# EAGLE schematic box (EAGLE 6.1)
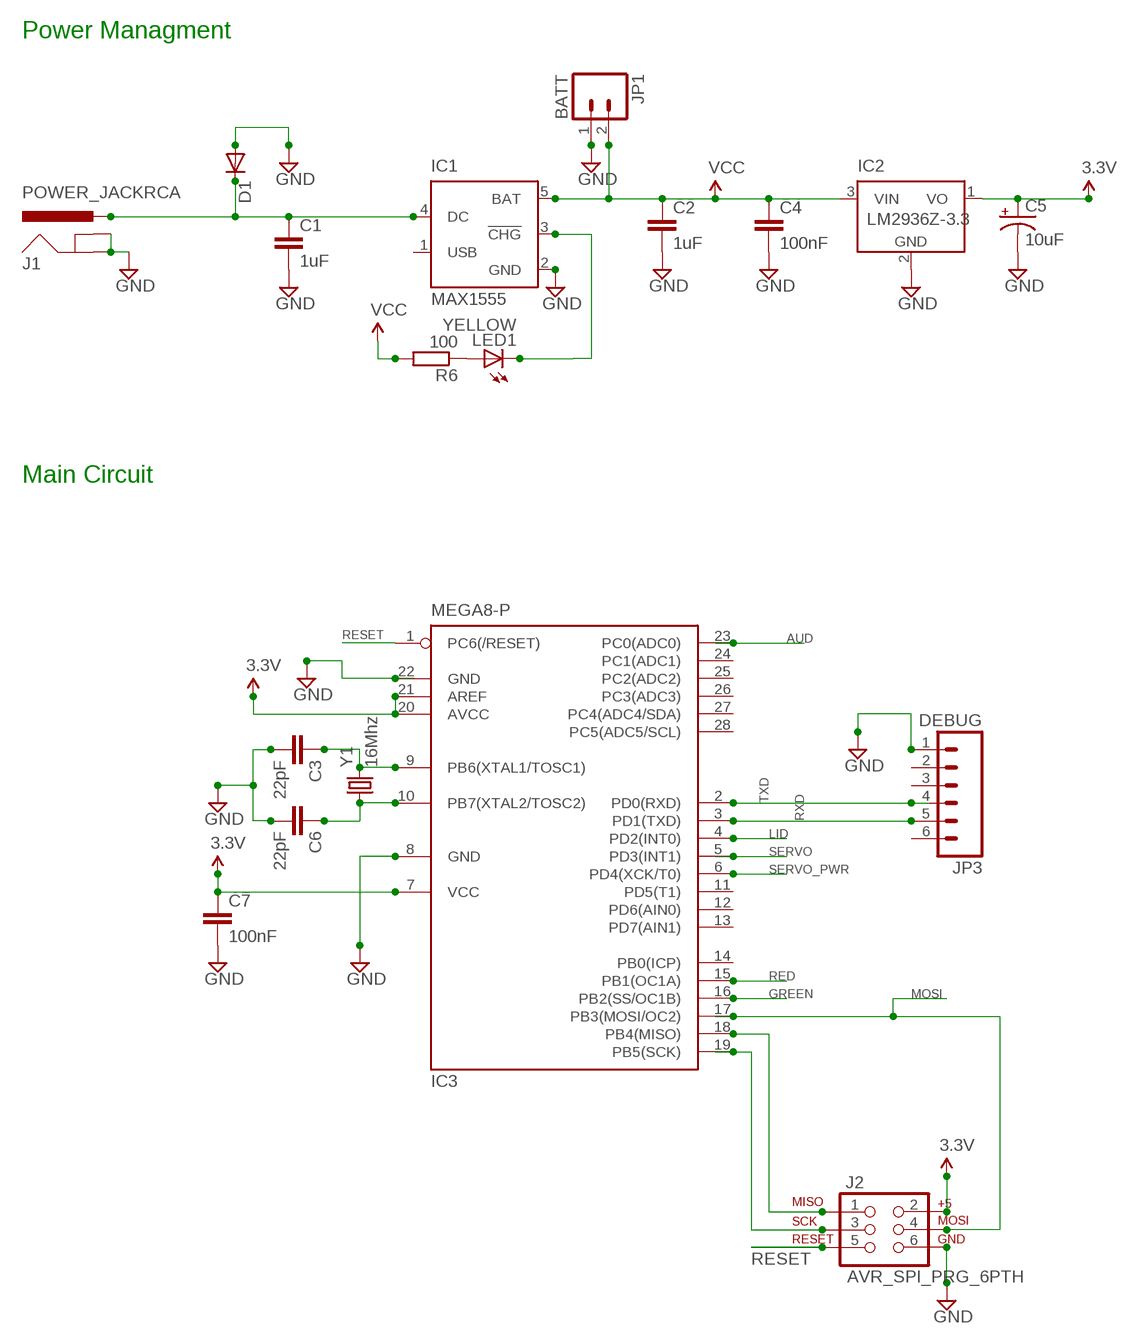
[diagram p0: schematic, sheet 1, part 1 of 2]
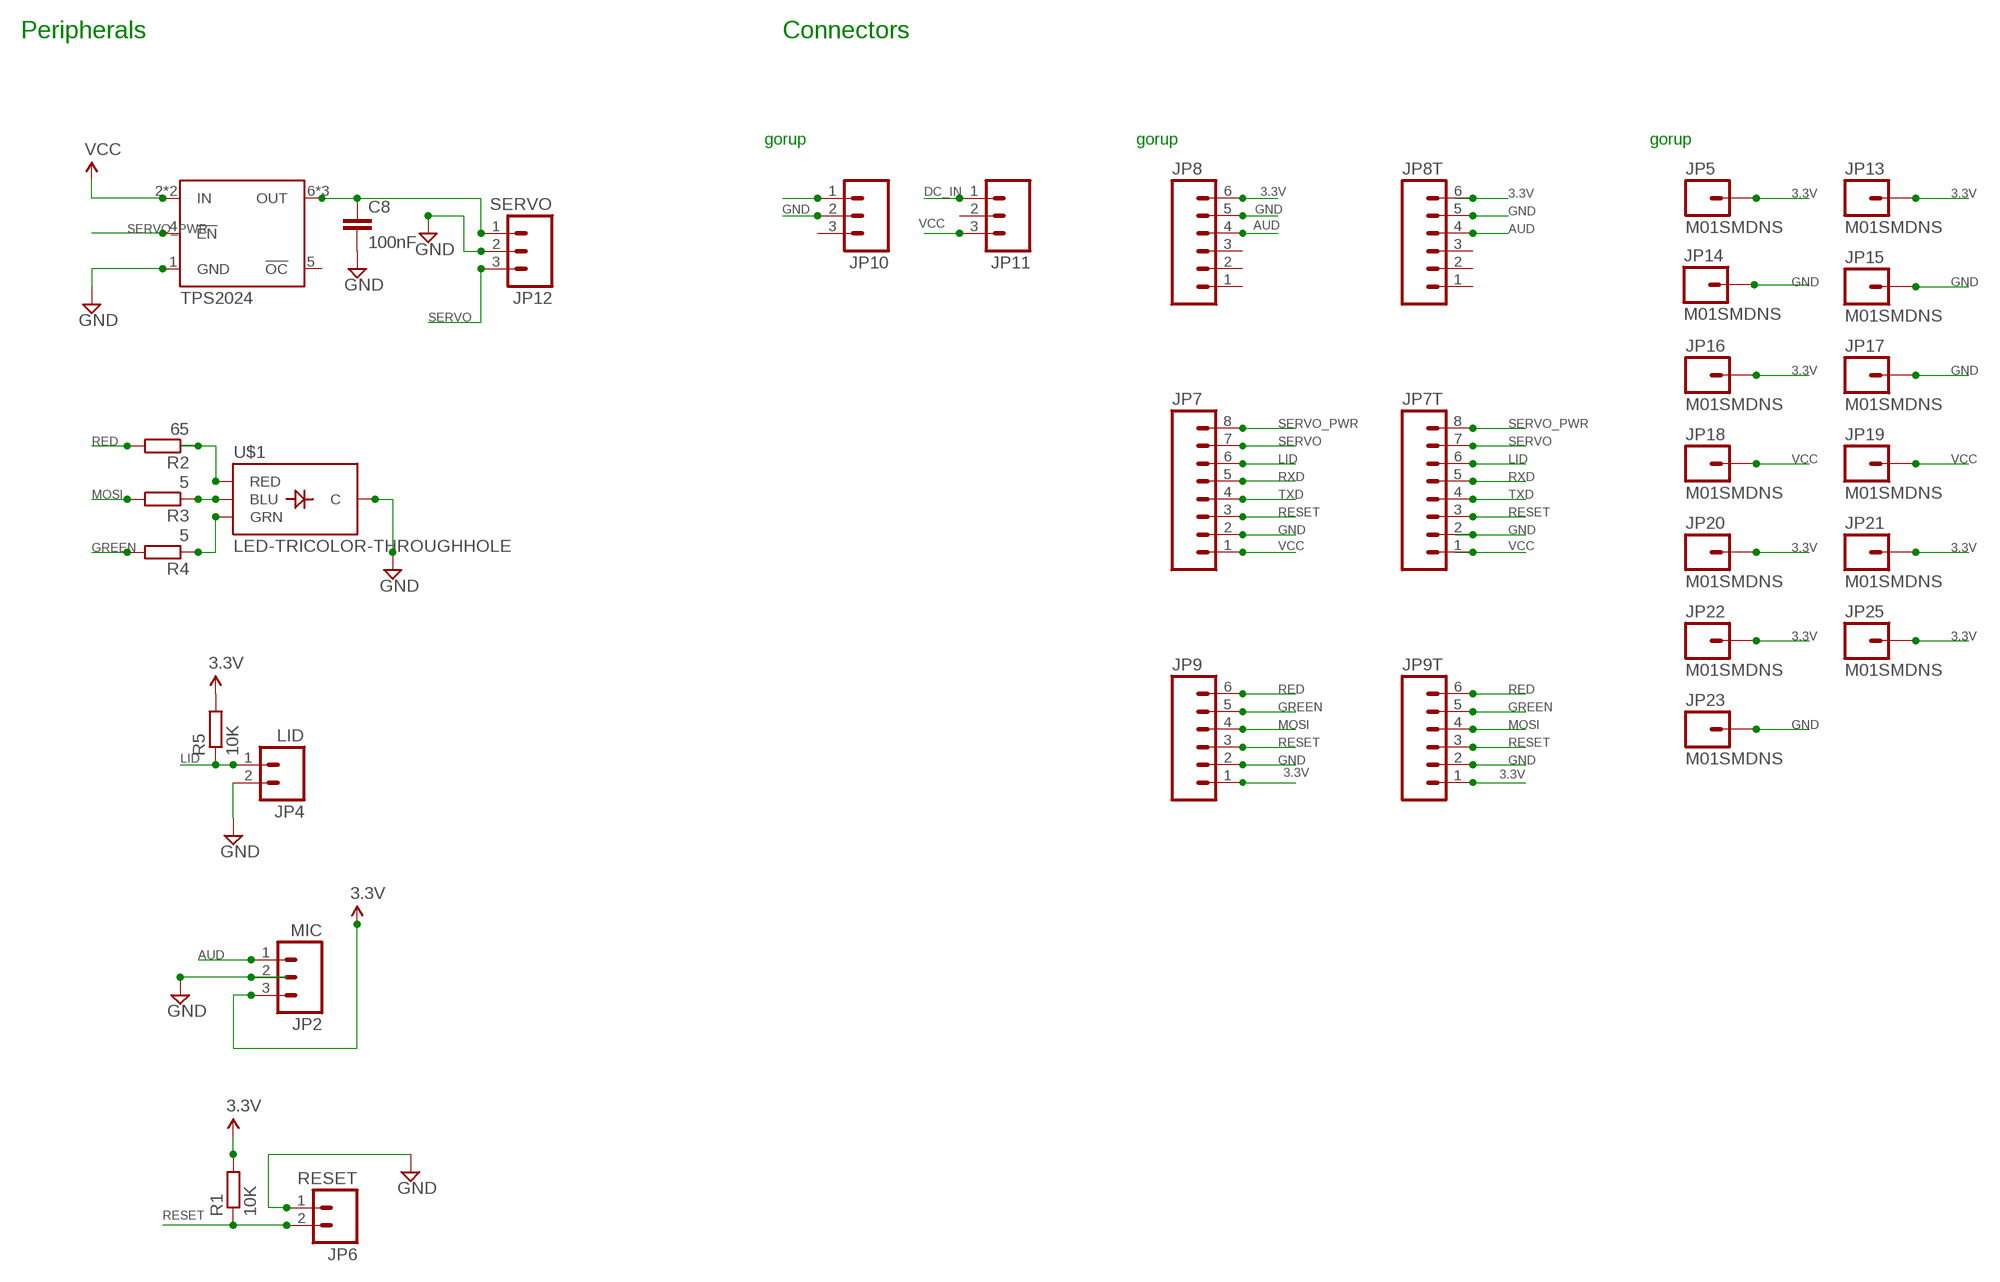
[diagram p1: schematic, sheet 1, part 2 of 2]

## Parts
C1  1uF  CAP_  [AXIAL-5MM]
C2  1uF  CAP_  [AXIAL-5MM]
C3  22pF  C2.5/2  [C2.5-2]
C4  100nF  C5/3.5  [C5B3.5]
C5  10uF  CAP_POLPTH2  [CPOL-RADIAL-10UF-25V]
C6  22pF  C2.5/2  [C2.5-2]
C7  100nF  C5/3.5  [C5B3.5]
C8  100nF  C5/3.5  [C5B3.5]
D1  DIODE-D-2.5  [D-2.5]
IC1  MAX1555  [SOT23-5L]
IC2  LM2936Z-3.3  [TO92]
IC3  MEGA8-P  [DIL28-3]
J1  POWER_JACKRCA  [RCA]
J2  AVR_SPI_PRG_6PTH  [2X3]
JP1  BATT  M02-JST-2-PTH-NO_SILK  [JST-2-PTH-NS]
JP2  MIC  M03PTH  [1X03]
JP3  DEBUG  M06SIP  [1X06]
JP4  LID  M02PTH  [1X02]
JP5  M01SMDNS  [1X01NS]
JP6  RESET  M02PTH  [1X02]
JP7  M081X08  [1X08]
JP7T  M081X08  [1X08]
JP8  M06SIP  [1X06]
JP8T  M06SIP  [1X06]
JP9  M06SIP  [1X06]
JP9T  M06SIP  [1X06]
JP10  M03PTH  [1X03]
JP11  M03PTH  [1X03]
JP12  SERVO  M03PTH  [1X03]
JP13  M01SMDNS  [1X01NS]
JP14  M01SMDNS  [1X01NS]
JP15  M01SMDNS  [1X01NS]
JP16  M01SMDNS  [1X01NS]
JP17  M01SMDNS  [1X01NS]
JP18  M01SMDNS  [1X01NS]
JP19  M01SMDNS  [1X01NS]
JP20  M01SMDNS  [1X01NS]
JP21  M01SMDNS  [1X01NS]
JP22  M01SMDNS  [1X01NS]
JP23  M01SMDNS  [1X01NS]
JP25  M01SMDNS  [1X01NS]
LED1  YELLOW  LED5MM  [LED5MM]
R1  10K  R-EU_0207/5V  [0207/5V]
R2  65  R-EU_0207/5V  [0207/5V]
R3  5  R-EU_0207/5V  [0207/5V]
R4  5  R-EU_0207/5V  [0207/5V]
R5  10K  R-EU_0207/5V  [0207/5V]
R6  100  R-EU_0207/5V  [0207/5V]
U$1  LED-TRICOLOR-THROUGHHOLE  [LED-TRICOLOR-THROUGHHOLE]
U$2  TPS2024  [DIL08-OPTO]
Y1  16Mhz  CRYSTALHC49US  [HC49US]

## Nets
3.3V: C5.1(+) C7.1 IC2.1(VO) IC3.7(VCC) IC3.20(AVCC) IC3.21(AREF) J2.2 JP2.3 JP5.1 JP8.6 JP8T.6 JP9.1 JP9T.1 JP13.1 JP16.1 JP20.1 JP21.1 JP22.1 JP25.1 R1.2 R5.2
AUD: IC3.23(PC0(ADC0)) JP2.1 JP8.4 JP8T.4
BLU-OUT: R3.1 U$1.BLU
CHG_OUT: IC1.3(!CHG) JP10.1 LED1.K(C)
DC_IN: C1.P$1 D1.C IC1.4(DC) J1.BREAK(PWR) JP11.1
GND: C1.P$2 C2.P$2 C3.2 C4.2 C5.2(-) C6.2 C7.2 C8.2 D1.A IC1.2(GND) IC2.2(GND) IC3.8(GND) IC3.22(GND) J1.BARREL(GND) J1.SPRING(GNDBREAK) J2.6 JP1.1 JP2.2 JP3.1 JP4.2 JP6.1 JP7.2 JP7T.2 JP8.5 JP8T.5 JP9.2 JP9T.2 JP10.2 JP12.2 JP14.1 JP15.1 JP17.1 JP23.1 U$1.GND(C) U$2.1(GND)
GREEN: IC3.16(PB2(SS/OC1B)) JP9.5 JP9T.5 R4.2
GRN-OUT: R4.1 U$1.GRN
LID: IC3.4(PD2(INT0)) JP4.1 JP7.6 JP7T.6 R5.1
MISO: IC3.18(PB4(MISO)) J2.1
MOSI: IC3.17(PB3(MOSI/OC2)) J2.4 JP9.4 JP9T.4 R3.2
N$1: LED1.A R6.1
RED: IC3.15(PB1(OC1A)) JP9.6 JP9T.6 R2.2
RED-OUT: R2.1 U$1.RED
RESET: IC3.1(PC6(/RESET)) J2.5 JP6.2 JP7.3 JP7T.3 JP9.3 JP9T.3 R1.1
RXD: IC3.3(PD1(TXD)) JP3.5 JP7.5 JP7T.5
SCK: IC3.19(PB5(SCK)) J2.3
SERVO: IC3.5(PD3(INT1)) JP7.7 JP7T.7 JP12.3
SERVO_PWR: IC3.6(PD4(XCK/T0)) JP7.8 JP7T.8 U$2.4(!EN)
SERVO_VCC: C8.1 JP12.1 U$2.6(OUT) U$2.7(OUT) U$2.8(OUT)
TXD: IC3.2(PD0(RXD)) JP3.4 JP7.4 JP7T.4
VCC: C2.P$1 C4.1 IC1.5(BAT) IC2.3(VIN) JP1.2 JP7.1 JP7T.1 JP11.3 JP18.1 JP19.1 R6.2 U$2.2(IN) U$2.3(IN)
XTAL9: C3.1 IC3.9(PB6(XTAL1/TOSC1)) Y1.2
XTAL19: C6.1 IC3.10(PB7(XTAL2/TOSC2)) Y1.1
Unconnected: IC1.1(USB) IC3.11(PD5(T1)) IC3.12(PD6(AIN0)) IC3.13(PD7(AIN1)) IC3.14(PB0(ICP)) IC3.24(PC1(ADC1)) IC3.25(PC2(ADC2)) IC3.26(PC3(ADC3)) IC3.27(PC4(ADC4/SDA)) IC3.28(PC5(ADC5/SCL)) JP3.2 JP3.3 JP3.6 JP8.1 JP8.2 JP8.3 JP8T.1 JP8T.2 JP8T.3 JP10.3 JP11.2 U$2.5(!OC)

## Notes on the sheet
- Power Managment
- Peripherals | Connectors
- gorup | gorup | gorup
- Main Circuit

## Library data of the parts
C1 C2 = SparkFun:CAP: Capacitor Standard 0603 ceramic capacitor, and 0.1" leaded capacitor.
C3 C4 C6-C8 = capacitor-wima:C: CAPACITOR naming: grid - package width
C5 = SparkFun:CAP_POL: Capacitor Polarized These are standard SMD and PTH capacitors. Normally 10uF, 47uF, and 100uF in electrolytic and tantalum varieties. Always verify the external diameter of the through hole cap, it varies with capacity, voltage, and manufacturer. The EIA devices should be standard.
D1 = diode:DIODE-: DIODE
IC1 = maxim:MAX1555: Dual-Input USB/AC Adapter 1-Cell Li+ Battery Chargers Source: http://www.maxim-ic.com .. MAX1551-MAX1555.pdf; MF: MAXIM; MPN: MAX1555EZK+T; OC_FARNELL: 1628222; OC_NEWARK: 59J2761
IC2 = national-semiconductor:LM2936?*: Ultra-Low Quiescent Current LDO Voltage Regulator Source: Data sheet <http://www.national.com/ds/LM/LM2936.pdf>; MF: NATIONAL SEMICONDUCTOR; MPN: LM2936Z-3.3/NOPB; OC_FARNELL: 1564641; OC_NEWARK: 41K4532
IC3 = atmel:MEGA8-P: MICROCONTROLLER 8 Kbytes FLASH, 1 kbytes SRAM, 512 bytes EEPROM, USART, 4-channel 10 bit ADC, 2-channel 8 bit ADC Pin compatible with Atmega48, ATMega88, ATMega168 Source: avr.lbr; OC_FARNELL: unknown; OC_NEWARK: unknown
J1 = SparkFun:POWER_JACK: Power Jack This is the standard 5.5mm barrel jack for power. The PTH is the most common, proven, reliable, footprint. All others are experimental. The Slot footprint only works if the mill layer is transmitted to the PCB fab house so be warned. Spark Fun Electronics SKU : PRT-00119. Mating wall wart : TOL-00298 (and others)
J2 = SparkFun:AVR_SPI_PRG_6: AVR ISP 6 Pin This is the reduced ISP connector for AVR programming. Common on Arduino. This footprint will take up less PCB space and can be used with a 10-pin to 6-pin adapter such as SKU: BOB-08508
JP1 JP4 JP6 = SparkFun:M02: Header 2 Standard 2-pin 0.1" header. Use with straight break away headers (SKU : PRT-00116), right angle break away headers (PRT-00553), swiss pins (PRT-00743), machine pins (PRT-00117), and female headers (PRT-00115). Molex polarized connector foot print use with SKU : PRT-08233 with associated crimp pins and housings.
JP2 JP10-JP12 = SparkFun:M03: Header 3 Standard 3-pin 0.1" header. Use with straight break away headers (SKU : PRT-00116), right angle break away headers (PRT-00553), swiss pins (PRT-00743), machine pins (PRT-00117), and female headers (PRT-00115). Molex polarized connector foot print use with SKU : PRT-08232 with associated crimp pins and housings.
JP3 JP8 JP8T JP9 JP9T = SparkFun:M06: Header 6 Standard 6-pin 0.1" header. Use with straight break away headers (SKU : PRT-00116), right angle break away headers (PRT-00553), swiss pins (PRT-00743), machine pins (PRT-00117), and female headers (PRT-00115). Molex polarized connector foot print use with SKU : PRT-08094 with associated crimp pins and housings. NOTES ON THE VARIANTS LOCK and LOCK_LONGPADS... This footprint was designed to help hold the alignment of a through-hole component (i.e. 6-pin header) while soldering it into place. You may notice that each hole has been shifted either up or down by 0.005 of an inch from it's more standard position (which is a perfectly straight line). This slight alteration caused the pins (the squares in the middle) to touch the edges of the holes. Because they are alternating, it causes a "brace" to hold the component in place. 0.005 has proven to be the perfect amount of "off-center" position when using our standard breakaway headers. Although looks a little odd when you look at the bare footprint, once you have a header in there, the alteration is very hard to notice. Also, if you push a header all the way into place, it is covered up entirely on the bottom side. This idea of altering the position of holes to aid alignment will be further integrated into the Sparkfun Library for other footprints. It can help hold any component with 3 or more connection pins.
JP5 JP13-JP23 JP25 = SparkFun:M01: Header 1 Standard 1-pin 0.1" header. Use with straight break away headers (SKU : PRT-00116), right angle break away headers (PRT-00553), swiss pins (PRT-00743), machine pins (PRT-00117), and female headers (PRT-00115).
JP7 JP7T = SparkFun:M08: Header 8 Standard 8-pin 0.1" header. Use with straight break away headers (SKU : PRT-00116), right angle break away headers (PRT-00553), swiss pins (PRT-00743), machine pins (PRT-00117), and female headers (PRT-00115).
LED1 = SparkFun:LED: LEDs Standard schematic elements and footprints for 5mm, 3mm, 1206, and 0603 sized LEDs. 5mm - Spark Fun Electronics SKU : COM-00529 (and others)
R1-R6 = resistor:R-EU_: RESISTOR, European symbol
U$1 = SparkFun:LED-TRICOLOR-THROUGHHOLE
U$2 = texas-extra:TPS2024
Y1 = SparkFun:CRYSTAL: Crystals Various standard crystals. Proven footprints. Spark Fun Electronics SKU : COM-00534